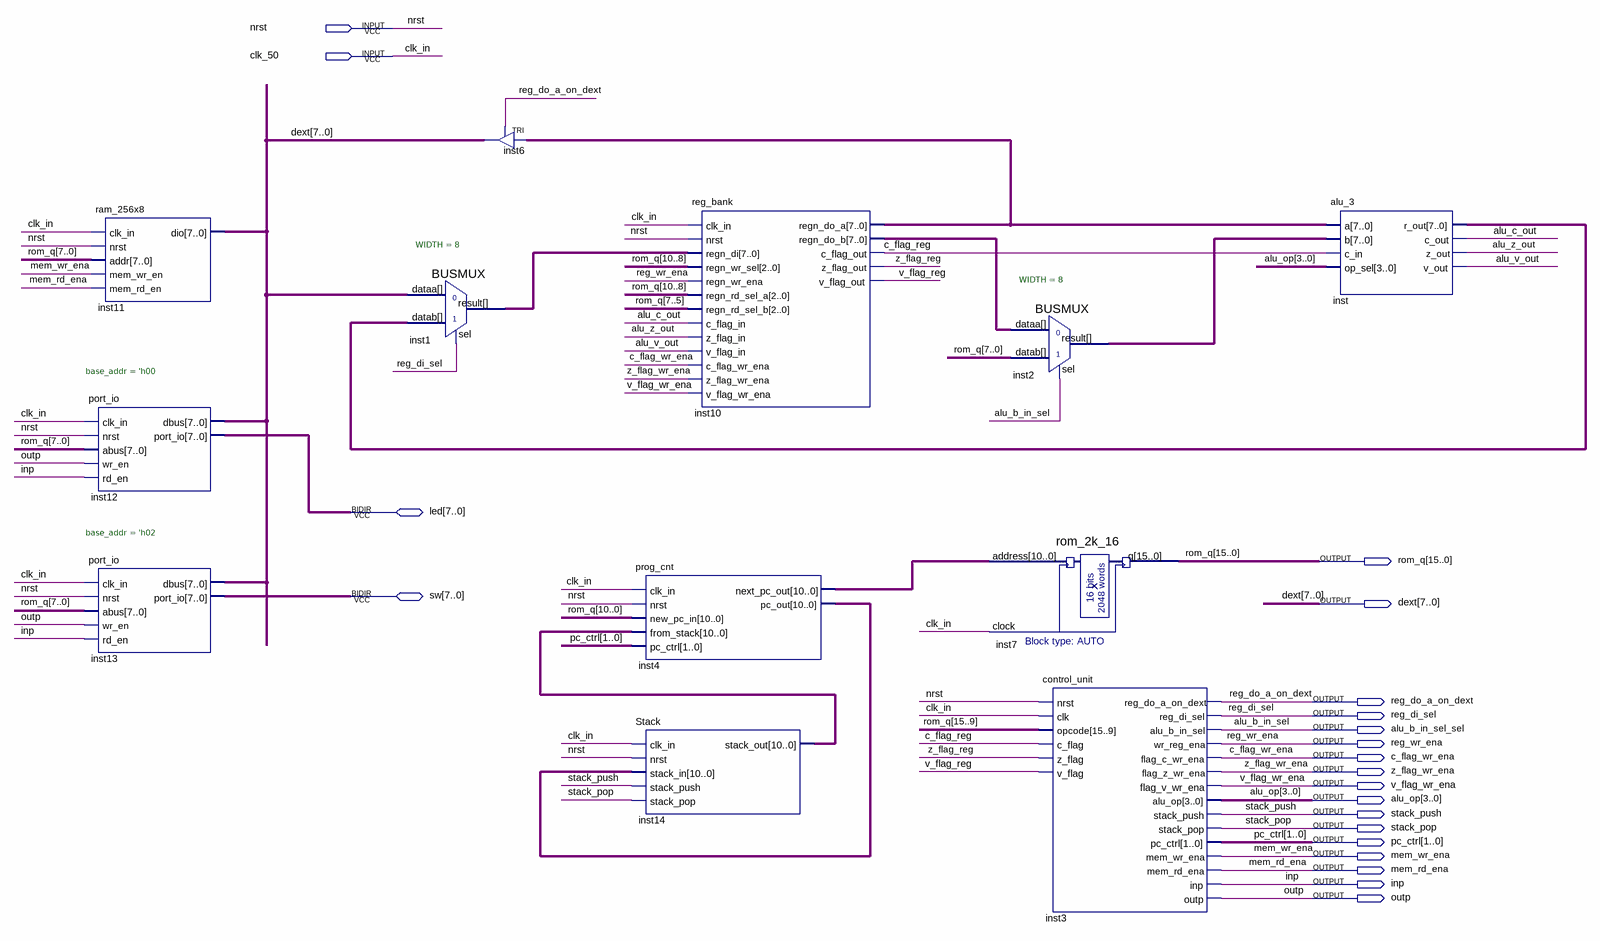
[diagram p0: schematic sheet]
// Quartus schematic PUC1-24.bdf as structural Verilog: 12 symbols, 21 pins
module \PUC1-24  (
  input  nrst,
  input  clk_50,
  inout  [7:0] led,
  inout  [7:0] sw,
  output [15:0] rom_q,
  output [7:0] dext,
  output reg_do_a_on_dext,
  output reg_di_sel,
  output alu_b_in_sel_sel,
  output reg_wr_ena,
  output c_flag_wr_ena,
  output z_flag_wr_ena,
  output v_flag_wr_ena,
  output [3:0] alu_op,
  output stack_push,
  output stack_pop,
  output [1:0] pc_ctrl,
  output mem_wr_ena,
  output mem_rd_ena,
  output inp,
  output outp
);

  wire alu_c_out, alu_v_out, alu_z_out, c_flag_reg, v_flag_reg, z_flag_reg;
  wire [7:0] inst1_result, inst2_result, inst10_regn_do_a, inst10_regn_do_b, inst_r_out;
  wire [10:0] inst4_next_pc_out, inst4_pc_out, inst14_stack_out;

  ram_256x8 inst11 (
    .clk_in(clk_50), .nrst(nrst), .addr(rom_q[7:0]), .mem_wr_en(mem_wr_ena), .mem_rd_en(mem_rd_ena),
    .dio(dext));
  port_io #(.base_addr('h00)) inst12 (
    .clk_in(clk_50), .nrst(nrst), .abus(rom_q[7:0]), .wr_en(outp), .rd_en(inp), .dbus(dext), .port_io(led));
  port_io #(.base_addr('h02)) inst13 (
    .clk_in(clk_50), .nrst(nrst), .abus(rom_q[7:0]), .wr_en(outp), .rd_en(inp), .dbus(dext), .port_io(sw));
  BUSMUX #(.WIDTH(8)) inst1 (.datab(inst_r_out), .sel(reg_di_sel), .dataa(dext), .result(inst1_result));
  TRI inst6[7:0] (.IN(inst10_regn_do_a), .OE(reg_do_a_on_dext), .OUT(dext));
  prog_cnt inst4 (
    .clk_in(clk_50), .nrst(nrst), .new_pc_in(rom_q[10:0]), .from_stack(inst14_stack_out), .pc_ctrl(pc_ctrl),
    .next_pc_out(inst4_next_pc_out), .pc_out(inst4_pc_out));
  Stack inst14 (
    .clk_in(clk_50), .nrst(nrst), .stack_in(inst4_pc_out), .stack_push(stack_push), .stack_pop(stack_pop),
    .stack_out(inst14_stack_out));
  reg_bank inst10 (
    .clk_in(clk_50), .nrst(nrst), .regn_di(inst1_result), .regn_wr_sel(rom_q[10:8]),
    .regn_wr_ena(reg_wr_ena), .regn_rd_sel_a(rom_q[10:8]), .regn_rd_sel_b(rom_q[7:5]), .c_flag_in(alu_c_out),
    .z_flag_in(alu_z_out), .v_flag_in(alu_v_out), .c_flag_wr_ena(c_flag_wr_ena),
    .z_flag_wr_ena(z_flag_wr_ena), .v_flag_wr_ena(v_flag_wr_ena), .regn_do_a(inst10_regn_do_a),
    .regn_do_b(inst10_regn_do_b), .c_flag_out(c_flag_reg), .z_flag_out(z_flag_reg), .v_flag_out(v_flag_reg));
  rom_2k_16 inst7 (.address(inst4_next_pc_out), .clock(clk_50), .q(rom_q));
  BUSMUX #(.WIDTH(8)) inst2 (
    .datab(rom_q[7:0]), .sel(alu_b_in_sel_sel), .dataa(inst10_regn_do_b), .result(inst2_result));
  control_unit inst3 (
    .nrst(nrst), .clk(clk_50), .opcode(rom_q[15:9]), .c_flag(c_flag_reg), .z_flag(z_flag_reg),
    .v_flag(v_flag_reg), .reg_do_a_on_dext(reg_do_a_on_dext), .reg_di_sel(reg_di_sel),
    .alu_b_in_sel(alu_b_in_sel_sel), .wr_reg_ena(reg_wr_ena), .flag_c_wr_ena(c_flag_wr_ena),
    .flag_z_wr_ena(z_flag_wr_ena), .flag_v_wr_ena(v_flag_wr_ena), .alu_op(alu_op), .stack_push(stack_push),
    .stack_pop(stack_pop), .pc_ctrl(pc_ctrl), .mem_wr_ena(mem_wr_ena), .mem_rd_ena(mem_rd_ena), .inp(inp),
    .outp(outp));
  alu_3 inst (
    .a(inst10_regn_do_a), .b(inst2_result), .c_in(c_flag_reg), .op_sel(alu_op), .r_out(inst_r_out),
    .c_out(alu_c_out), .z_out(alu_z_out), .v_out(alu_v_out));

  // Other names for the same wires on the sheet: alu_b_in_sel = alu_b_in_sel_sel; clk_in = clk_50
endmodule
